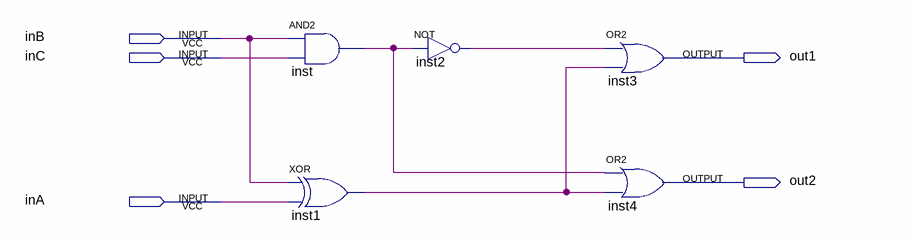
[diagram p0: schematic sheet]
// Quartus schematic LAB5ADDER2.bdf as structural Verilog: 5 symbols, 5 pins
module LAB5ADDER2 (
  input  inB,
  input  inC,
  input  inA,
  output out1,
  output out2
);

  wire inst1_out, inst2_out, inst_out;

  and inst (inst_out, inB, inC);
  xor inst1 (inst1_out, inB, inA);
  not inst2 (inst2_out, inst_out);
  or inst3 (out1, inst2_out, inst1_out);
  or inst4 (out2, inst_out, inst1_out);
endmodule
